# EAGLE design RJ45 Breakout (EAGLE 9.6.2)
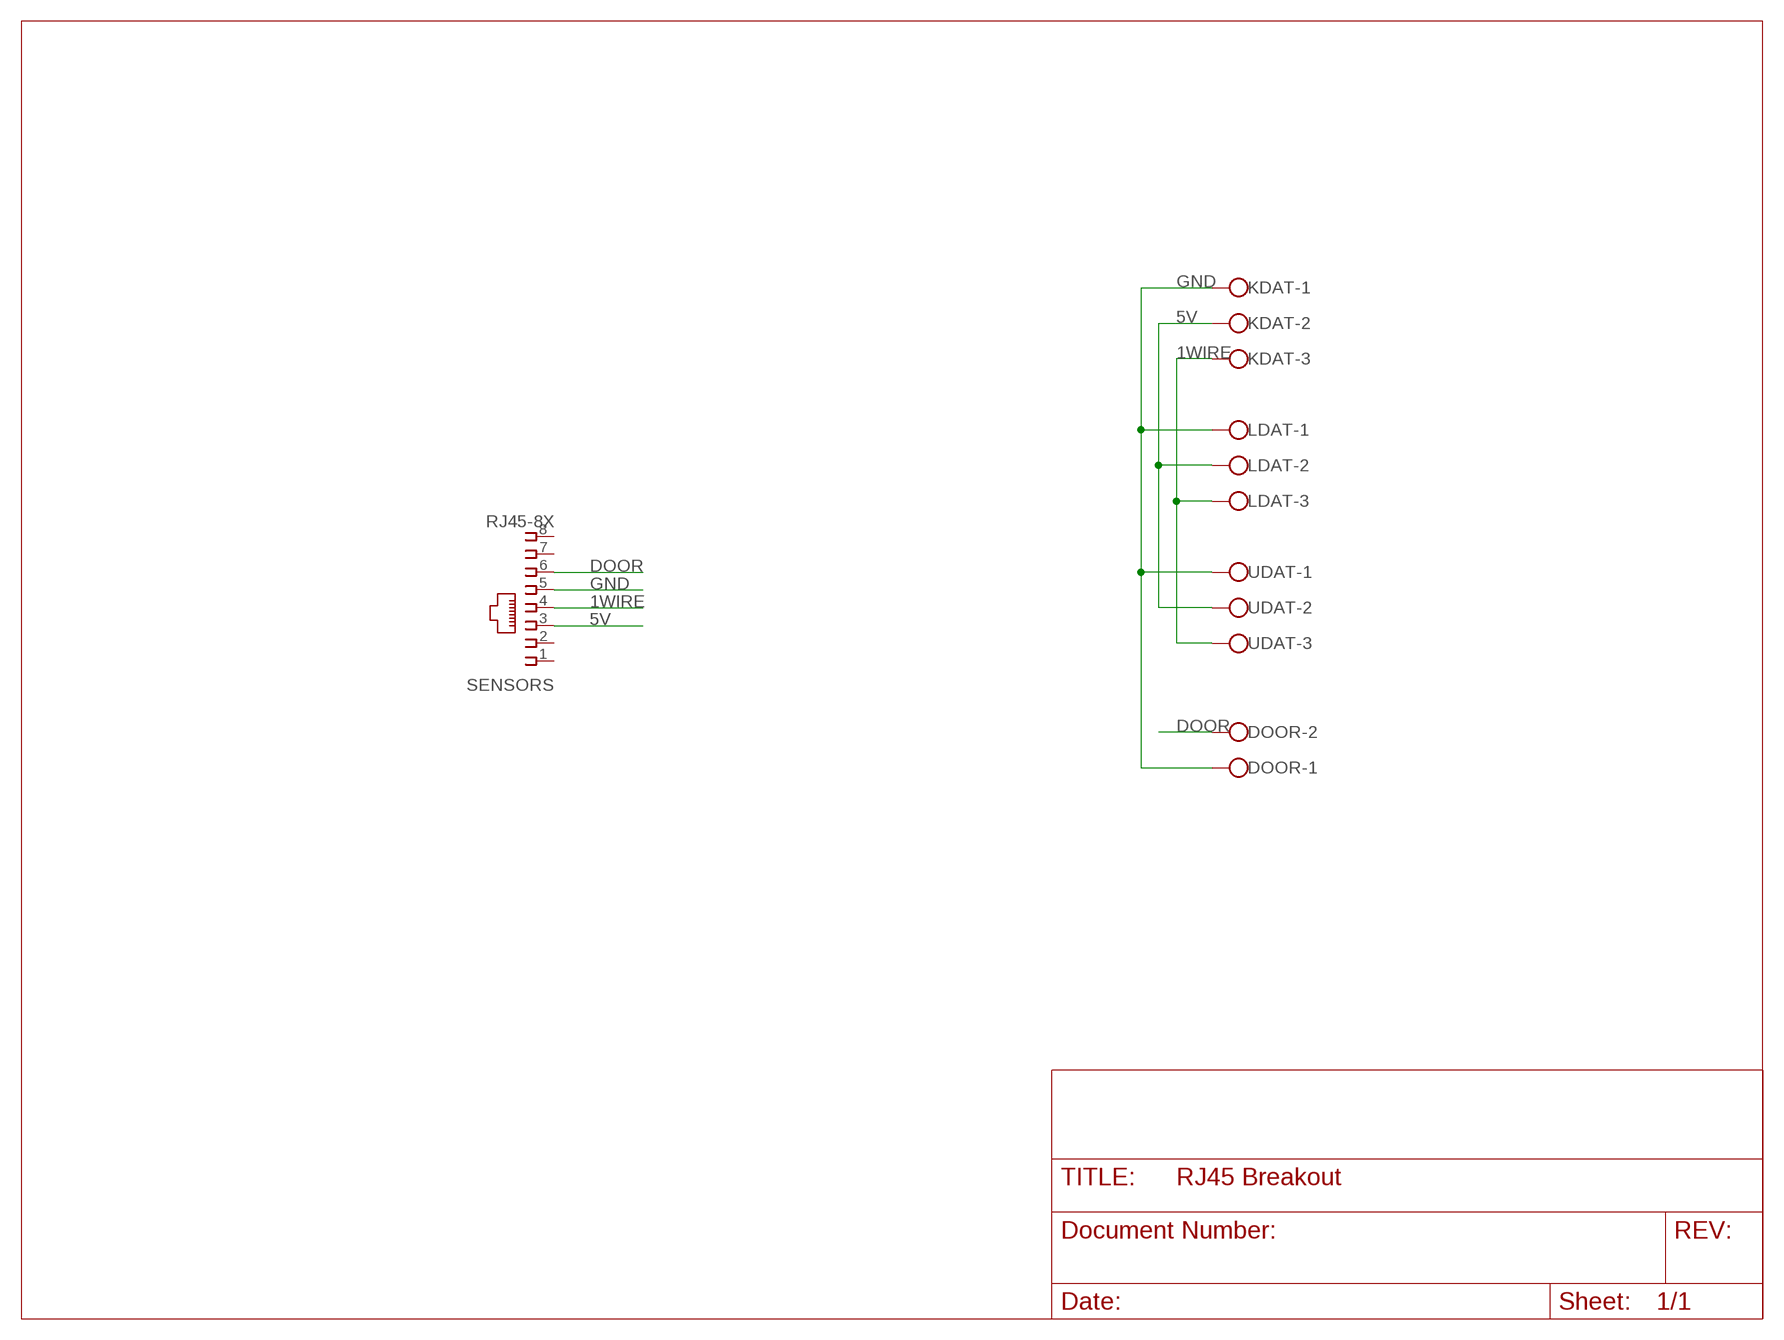
[diagram p0: schematic, sheet 1]

## Parts
DOOR  W237-102  [W237-102]
KDAT  W237-103  [W237-103]
LDAT  W237-103  [W237-103]
SENSORS  RJ45-8X  [RJ45-NO-SHIELD]
UDAT  W237-103  [W237-103]

## Nets
1WIRE: KDAT.3 LDAT.3 SENSORS.4 UDAT.3
5V: KDAT.2 LDAT.2 SENSORS.3 UDAT.2
DOOR: DOOR.2 SENSORS.6
GND: DOOR.1 KDAT.1 LDAT.1 SENSORS.5 UDAT.1
Unconnected: SENSORS.1 SENSORS.2 SENSORS.7 SENSORS.8

## Library data of the parts
DOOR = con-wago-500:W237-102: WAGO SCREW CLAMP; MPN: 237-102; OC_FARNELL: unknown; OC_NEWARK: 70K9898
KDAT LDAT UDAT = con-wago-500:W237-103: WAGO SCREW CLAMP; MPN: 237-103; OC_FARNELL: unknown; OC_NEWARK: 18M7116
SENSORS = con-tycoelectronics:RJ45: CORCOM Modular RJ Jacks No Shield Source: www.tycoelectronics.com .. ENG_DS_1654001_1099_RJ_L_0507.pdf; MPN: RJ45-8X; OC_FARNELL: unknown; OC_NEWARK: 16R6101

## Board
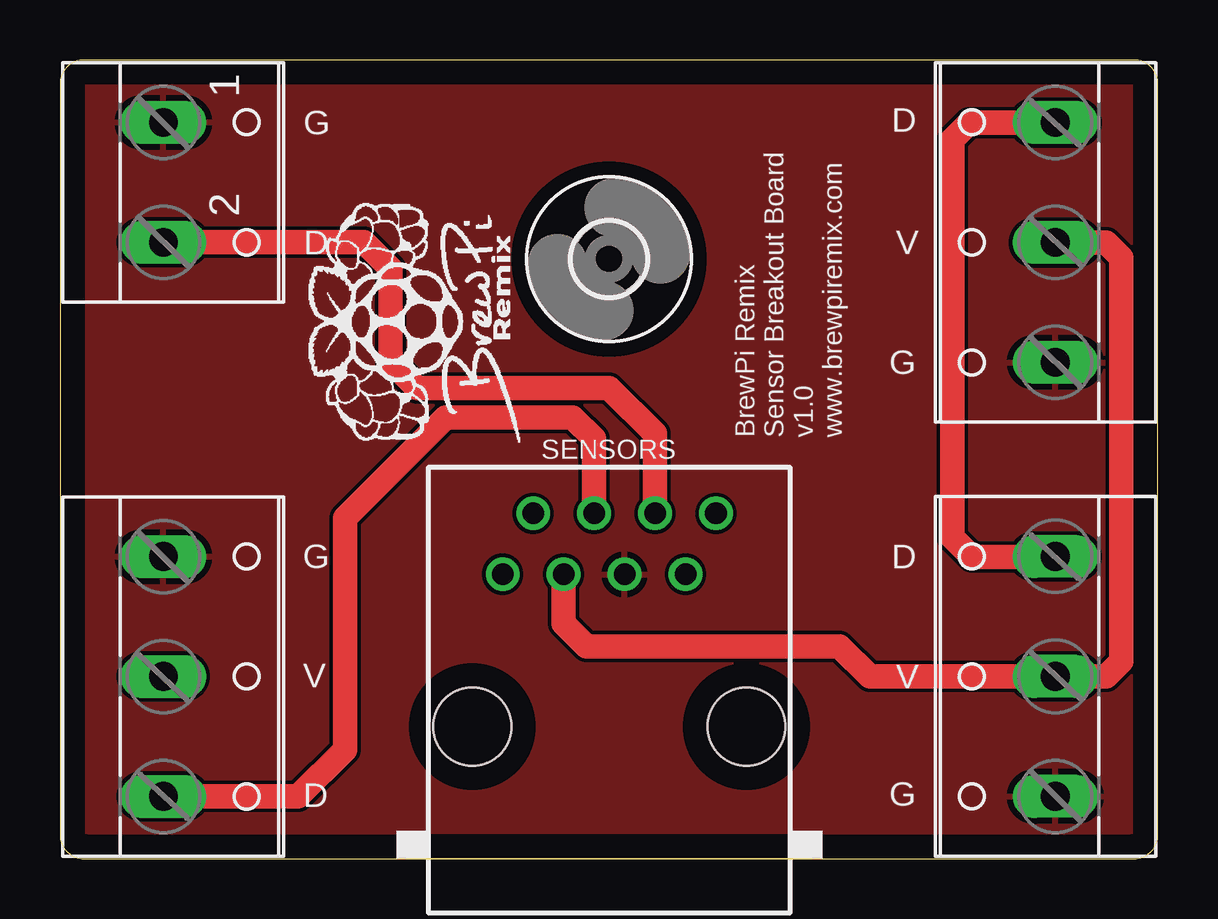
[diagram p1: board, top side]
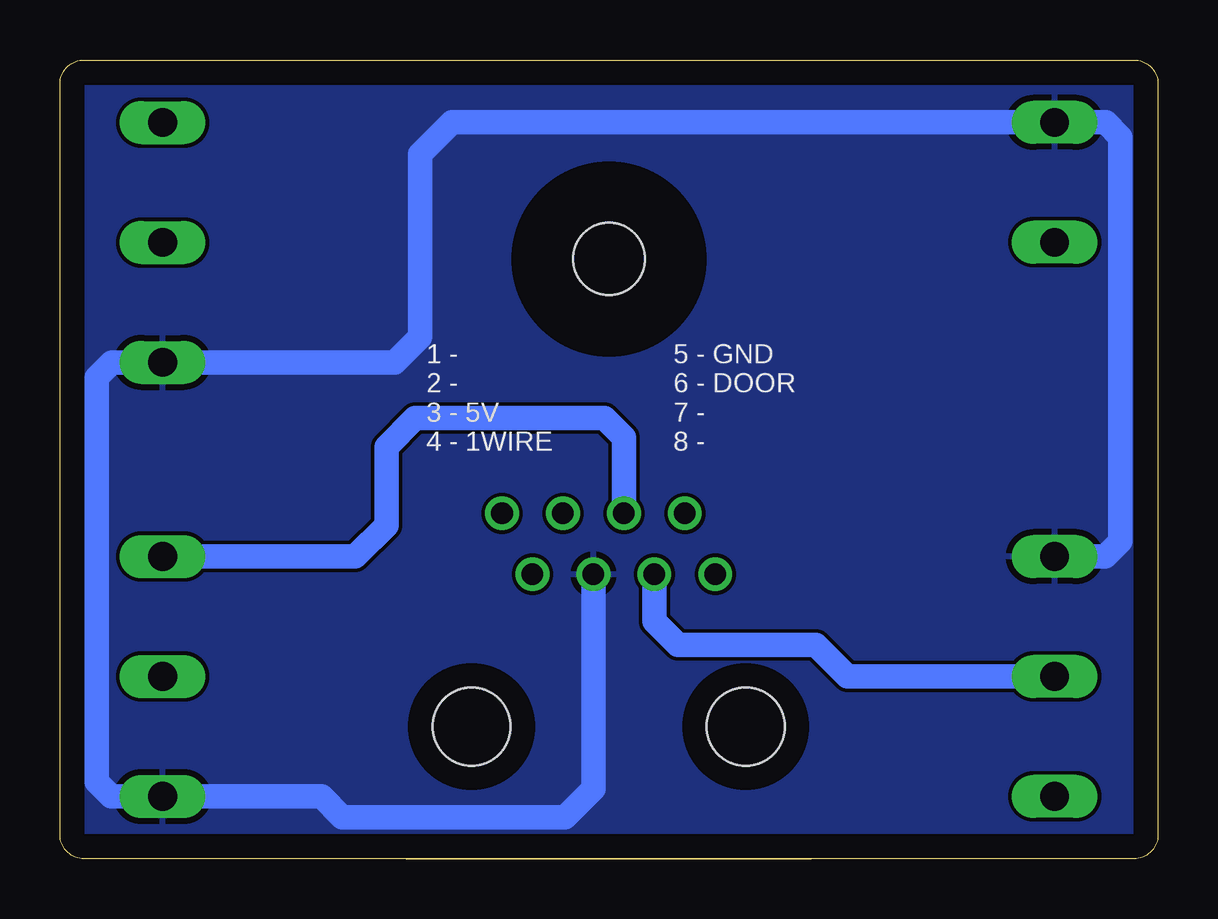
[diagram p2: board, bottom side, seen from below]

Size 45.77 x 33.3 mm. Coordinates in mm from the lower left corner, seen from the top.
Outline: 0,32.3 0,1 arc90 1,0 44.77,0 arc90 45.77,1 45.77,32.3 arc90 44.77,33.3 1,33.3 arc90 0,32.3
Copper layers (1*16): Top 0.035mm / dielectric 1.5mm / Bottom 0.035mm
Design rules "default": minimum track width 6mil, minimum drill 0.35mm, track to track 6mil, track to pad 6mil, pad to pad 6mil, via to via 6mil, smd to smd 6mil, copper to edge 40mil, drill to drill 6mil, minimum pad ring 10mil, minimum via ring 8mil, stop-mask expansion 4mil, vias tented up to drill 0mil, thermal gap 10mil

### Footprints (pad centres in the part's own frame; a part is rotated, then mirrored left to right if it is on the bottom)
W237-102 = drill 1.194 long: 1 -2.5,-1.27; 2 2.5,-1.27
W237-103 = drill 1.194 long: 1 -5,-1.29; 2 0,-1.29; 3 5,-1.29
RJ45-NO-SHIELD = drill 0.9 pad 1.4: 1 -4.445,6.35; 2 -3.175,8.89; 3 -1.905,6.35; 4 -0.635,8.89; 5 0.635,6.35; 6 1.905,8.89; 7 3.175,6.35; 8 4.445,8.89 | hole 3.251: -5.715,0; 5.715,0
3,0 = hole 3: 0,0

### Placement (x,y rotation side)
DOOR  5.58,28.2 270 top
KDAT  40.2,7.6 90 top
LDAT  40.2,25.69 90 top
SENSORS  22.9,5.51 0 top
U$1  [3,0]  22.88,25 0 top
UDAT  5.6,7.6 270 top

### Tracks (layer width: path | path; a pad name or v marks a point on that pad's centre or on a via)
1WIRE
  Top 1.016: LDAT.3 37.91,30.69 37.2,29.99 37.2,13.4 38.01,12.59 41.48,12.59 KDAT.3 | SENSORS.4 22.27,17.51 21.37,18.4 16.08,18.4 11.88,14.2 11.88,4.54 9.94,2.6 UDAT.3
  Bottom 1.016: SENSORS.4 22.27,17.57 23.07,18.37 30.96,18.37 32.16,17.17 32.16,13.9 33.46,12.6 KDAT.3
5V
  Top 1.016: SENSORS.3 20.99,9.8 21.94,8.85 32.5,8.85 33.75,7.6 KDAT.2 43.61,7.6 44.24,8.24 44.24,25.06 43.61,25.69 LDAT.2
  Bottom 1.016: UDAT.2 12.95,7.6 14.27,8.92 20.02,8.92 20.99,9.9 SENSORS.3
DOOR
  Top 1.016: SENSORS.6 24.8,17.72 22.9,19.63 14.89,19.63 13.77,20.75 13.77,24.61 12.68,25.7 DOOR.2
GND
  Bottom 1.016: UDAT.1 2.2,12.6 1.57,13.23 1.57,30.09 2.18,30.7 DOOR.1 29.44,30.7 30.77,29.37 30.77,21.74 31.81,20.69 LDAT.1 43.61,20.69 44.24,20.07 44.24,3.2 43.63,2.6 KDAT.1 34.87,2.6 34.01,1.74 24.72,1.74 23.53,2.92 SENSORS.5
  pour Top: 0.01,33.3 45.73,33.3 45.79,33.24 45.81,33.22 45.81,0.01 0.01,0.01
  pour Bottom: -0.01,33.32 45.76,33.32 45.76,0.02 0.06,0.02 arc-45 0.02,0.03

### Text on the board
tNames: G | D | D | V | G | BrewPi Remix / Sensor Breakout Board / v1.0 / www.brewpiremix.com | G | D | V | V | D | G
bNames: 5 - GND / 6 - DOOR / 7 - / 8 - | 1 - / 2 - / 3 - 5V / 4 - 1WIRE